# Altium schematic sheet Embedded_Circuits.SchDoc
size A; SheetNumber: 3; SheetTotal: 9
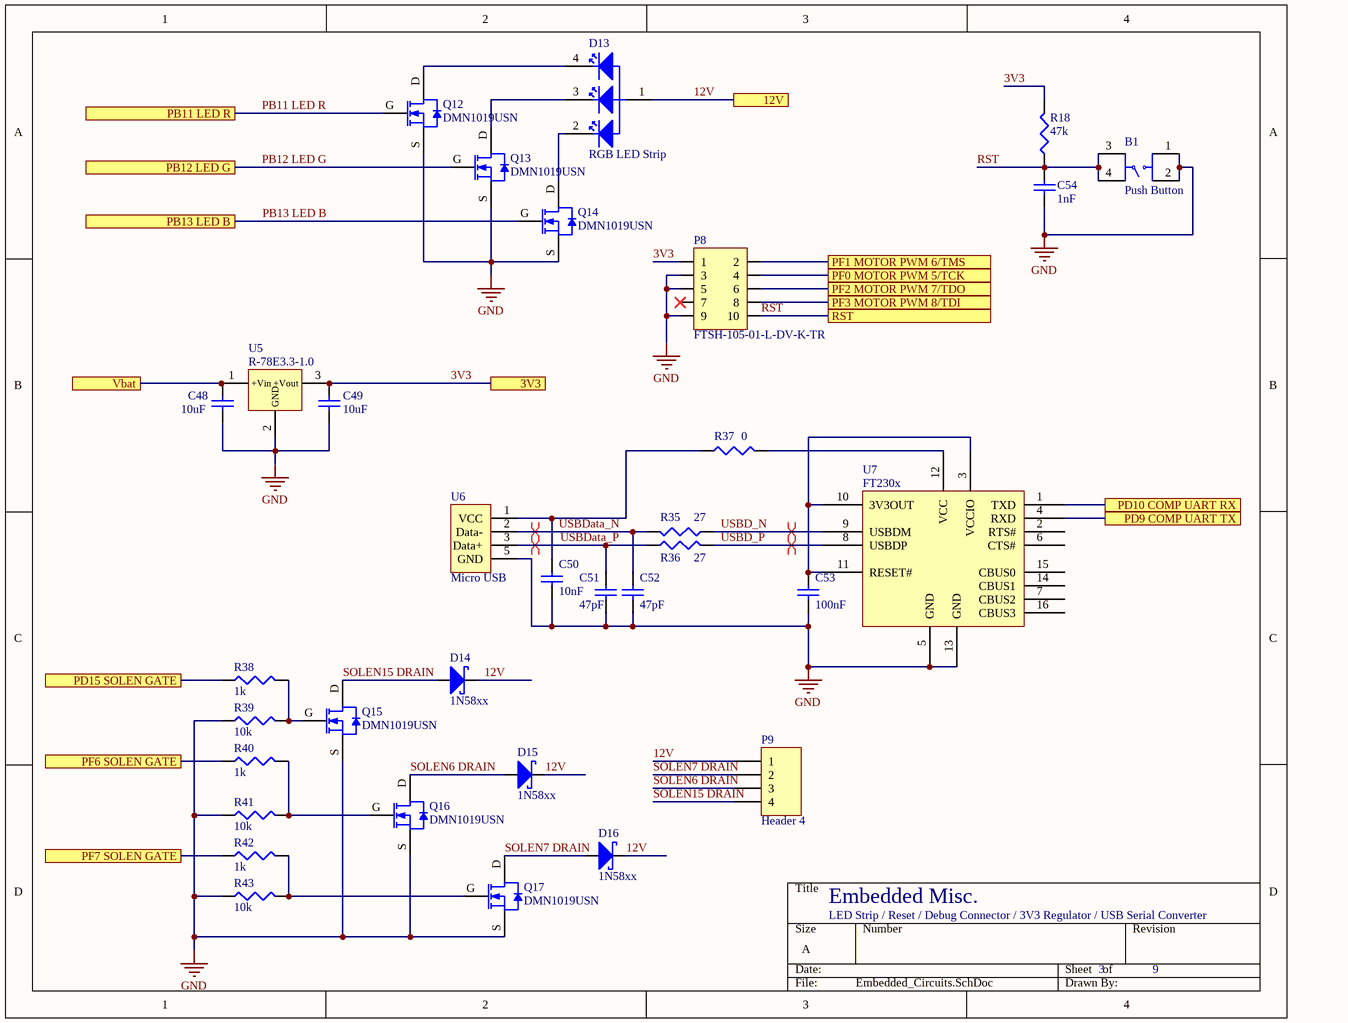
[diagram p0: Embedded_Circuits.SchDoc]

## Parts
B1  Push Button  [Push Button]
C48  value 10uF  [C1206]  (hidden comment: Cap)
C49  value 10uF  [C1206]  (hidden comment: Cap)
C50  value 10nF  [C1206]  (hidden comment: Cap)
C51  value 47pF  [C1206]  (hidden comment: Cap)
C52  value 47pF  [C1206]  (hidden comment: Cap)
C53  value 100nF  [C1206]  (hidden comment: Cap)
C54  value 1nF  [C1206]  (hidden comment: Cap Semi)
D13  RGB LED Strip  [Header 1x4]
D14  1N58xx  [1N58xx]
D15  1N58xx  [1N58xx]
D16  1N58xx  [1N58xx]
P8  FTSH-105-01-L-DV-K-TR  [FTSH-105-01-L-DV-K-TR]
P9  Header 4  [Header 1x4]
Q12  DMN1019USN  [SOT-23]
Q13  DMN1019USN  [SOT-23]
Q14  DMN1019USN  [SOT-23]
Q15  DMN1019USN  [SOT-23]
Q16  DMN1019USN  [SOT-23]
Q17  DMN1019USN  [SOT-23]
R18  value 47k  [J1-0603]  (hidden comment: Res3)
R35  value 27  [J1-0603]  (hidden comment: Res3)
R36  value 27  [J1-0603]  (hidden comment: Res3)
R37  value 0  [J1-0603]  (hidden comment: Res3)
R38  value 1k  [J1-0603]  (hidden comment: Res3)
R39  value 10k  [J1-0603]  (hidden comment: Res3)
R40  value 1k  [J1-0603]  (hidden comment: Res3)
R41  value 10k  [J1-0603]  (hidden comment: Res3)
R42  value 1k  [J1-0603]  (hidden comment: Res3)
R43  value 10k  [J1-0603]  (hidden comment: Res3)
U5  R-78E3.3-1.0  [R-78Exx-1.0]
U6  Micro USB  [Micro USB]
U7  FT230x  [FT230X]

## Ports
3V3, 12V, PB11 LED R, PB12 LED G, PB13 LED B, PD9 COMP UART TX, PD10 COMP UART RX, PD15 SOLEN GATE, PF0 MOTOR PWM 5/TCK, PF1 MOTOR PWM 6/TMS, PF2 MOTOR PWM 7/TDO, PF3 MOTOR PWM 8/TDI, PF6 SOLEN GATE, PF7 SOLEN GATE, RST, Vbat

## Nets
GND: B1.1 B1.2 C48.1 C49.1 C50.1 C51.1 C52.1 C53.1 C54.1 P8.3 P8.5 P8.9 Q12.S Q13.S Q14.S Q15.S Q16.S Q17.S R39.1 R41.1 R43.1 U5.2(GND) U6.5(GND) U7.5(GND) U7.13(GND)
3V3: C49.2 P8.1 R18.2 U5.3(+Vout) ; port 3V3
12V: D13.1 D14.K(Cathode) D15.K(Cathode) D16.K(Cathode) P9.1 ; port 12V
PB11 LED R: Q12.G ; port PB11 LED R
PB12 LED G: Q13.G ; port PB12 LED G
PB13 LED B: Q14.G ; port PB13 LED B
PD9 COMP UART TX: U7.4(RXD) ; port PD9 COMP UART TX
PD10 COMP UART RX: U7.1(TXD) ; port PD10 COMP UART RX
PD15 SOLEN GATE: R38.1 ; port PD15 SOLEN GATE
PF0 MOTOR PWM 5/TCK: P8.4 ; port PF0 MOTOR PWM 5/TCK
PF1 MOTOR PWM 6/TMS: P8.2 ; port PF1 MOTOR PWM 6/TMS
PF2 MOTOR PWM 7/TDO: P8.6 ; port PF2 MOTOR PWM 7/TDO
PF3 MOTOR PWM 8/TDI: P8.8 ; port PF3 MOTOR PWM 8/TDI
PF6 SOLEN GATE: R40.1 ; port PF6 SOLEN GATE
PF7 SOLEN GATE: R42.1 ; port PF7 SOLEN GATE
RST: B1.3 B1.4 C54.2 P8.10 R18.1 ; port RST
SOLEN6 DRAIN: D15.A(Anode) P9.3 Q16.D
SOLEN7 DRAIN: D16.A(Anode) P9.2 Q17.D
SOLEN15 DRAIN: D14.A(Anode) P9.4 Q15.D
USBD_N: R35.1 U7.9(USBDM)
USBD_P: R36.2 U7.8(USBDP)
USBData_N: C52.2 R35.2 U6.2(Data-)
USBData_P: C51.2 R36.1 U6.3(Data+)
Vbat: C48.2 U5.1(+Vin) ; port Vbat
NetC50_2: C50.2 R37.1 U6.1(VCC)
NetC53_2: C53.2 U7.3(VCCIO) U7.10(3V3OUT) U7.11(RESET#)
NetD13_2: D13.2 Q14.D
NetD13_3: D13.3 Q13.D
NetD13_4: D13.4 Q12.D
NetQ15_G: Q15.G R38.2 R39.2
NetQ16_G: Q16.G R40.2 R41.2
NetQ17_G: Q17.G R42.2 R43.2
NetR37_2: R37.2 U7.12(VCC)

Not connected (* = marked no-connect by the designer): P8 7*; U7 2(RTS#) 6(CTS#) 7(CBUS2) 14(CBUS1) 15(CBUS0) 16(CBUS3)

## Layout directives
differential pair: USBD_N, USBD_P, USBData_N, USBData_P

## Notes on the sheet
- Embedded Misc.
- LED Strip / Reset / Debug Connector / 3V3 Regulator / USB Serial Converter

## Library data of the parts
B1 = Push Button: Tactile Switch SPST-NO Top Actuated Through Hole; Digikey Link: https://www.digikey.com/product-detail/en/te-connectivity-alcoswitch-switches/FSM101/450-1157-ND/701084; Drawing: https://www.te.com/commerce/DocumentDelivery/DDEController?Action=srchrtrv&DocNm=1571140&DocType=Customer+Drawing&DocLang=English
C48-C53 = Cap: Capacitor; Published: 8-Jun-2000; LatestRevisionDate: 17-Jul-2002; LatestRevisionNote: Re-released for DXP Platform.; PackageReference: RAD-0.3; Publisher: Altium Limited; PackageDescription: Radial Cap, Thru-Hole; 2 Leads; 0.3 in Pin Spacing; Supplier 1: Digi-Key
  C48 C49: Supplier Part Number 1: 1276-2872-1-ND
  C50: Supplier Part Number 1: 1276-1921-1-ND
  C51 C52: Supplier Part Number 1: 490-16375-1-ND
  C53: Supplier Part Number 1: 1276-1001-1-ND
C54 = Cap Semi: Capacitor (Semiconductor SIM Model); Published: 8-Jun-2000; LatestRevisionDate: 29-May-2009; LatestRevisionNote: IPC-7351 Footprint Added.; PackageReference: C1206; Publisher: Altium Limited; PackageDescription: Chip Capacitor; Supplier 1: Digi-Key; Supplier Part Number 1: 490-4761-1-ND
D13 = RGB LED Strip: LED RGB Strip - Bare Nonaddressable; Sparkfun Link: https://www.sparkfun.com/products/12021
D14-D16 = 1N58xx: 1A Schottky Barrier Rectifier Diode; Datasheet: http://www.kesenes.com/pdf/1n5817-1n5819.pdf; Digikey: https://www.digikey.com/product-detail/en/comchip-technology/SS24-HF/641-SS24-HFCT-ND/10443817
P8 = JTAG Header: CONN HEADER 10POS DUAL .05" SMD; Digikey Link: https://www.digikey.com/product-detail/en/samtec-inc/FTSH-105-01-L-DV-K-TR/SAM13165CT-ND/8827920; Drawings: http://suddendocs.samtec.com/prints/ftsh-1xx-xx-xxx-dv-xxx-xxx-mkt.pdf; Datasheet: http://suddendocs.samtec.com/catalog_english/ftsh_smt.pdf
P9 = Header 4: Header, 4-Pin; LatestRevisionDate: 17-Jul-2002; LatestRevisionNote: Re-released for DXP Platform.; Publisher: Altium Limited
Q12-Q17 = DMN1019USN: 12V N-Channel Enhancement Mode MOSFET; Datasheet: https://www.diodes.com/assets/Datasheets/DMN1019USN.pdf; Digikey: https://www.digikey.com/product-detail/en/diodes-incorporated/DMN1019USN-13/DMN1019USN-13DICT-ND/4898885
R18 R35-R43 = Res3: Resistor; Published: 8-Jun-2000; LatestRevisionDate: 29-May-2009; LatestRevisionNote: IPC-7351 Footprint Added.; PackageReference: J1-0603; Publisher: Altium Limited; PackageDescription: Chip Resistor
U5 = R-78Exx-1.0: 1A DC/DC Voltage Converter; Datasheet: https://www.recom-power.com/pdf/Innoline/R-78Exx-0.5.pdf
U6 = Micro USB: USB - micro B USB 2.0 Receptacle Connector 5 Position Surface Mount, Right Angle; Digikey: https://www.digikey.com/product-detail/en/molex-llc/1050170001/WM1399CT-ND/2350885; Datasheet: https://www.molex.com/pdm_docs/sd/1050170001_sd.pdf
U7 = FTDI FT230x: USB to Basic UART IC; Datasheet: https://www.ftdichip.com/Support/Documents/DataSheets/ICs/DS_FT230X.pdf